# EasyEDA Pro project 嵌入式教学实验板-插件版-20240226.eprj

# Schematic 嵌入式教学实验PCB板原理图
Create Date: 2024-01-30; Page Name: P1; Project Name: 嵌入式教学实验; Schematic Name: 嵌入式教学实验PCB板原理图; Update Date: 2024-02-25; Company: 机器人工程系; Drawed: 白小帆; Page Size: A4; Reviewed: 张宏昌; Version: V1.0
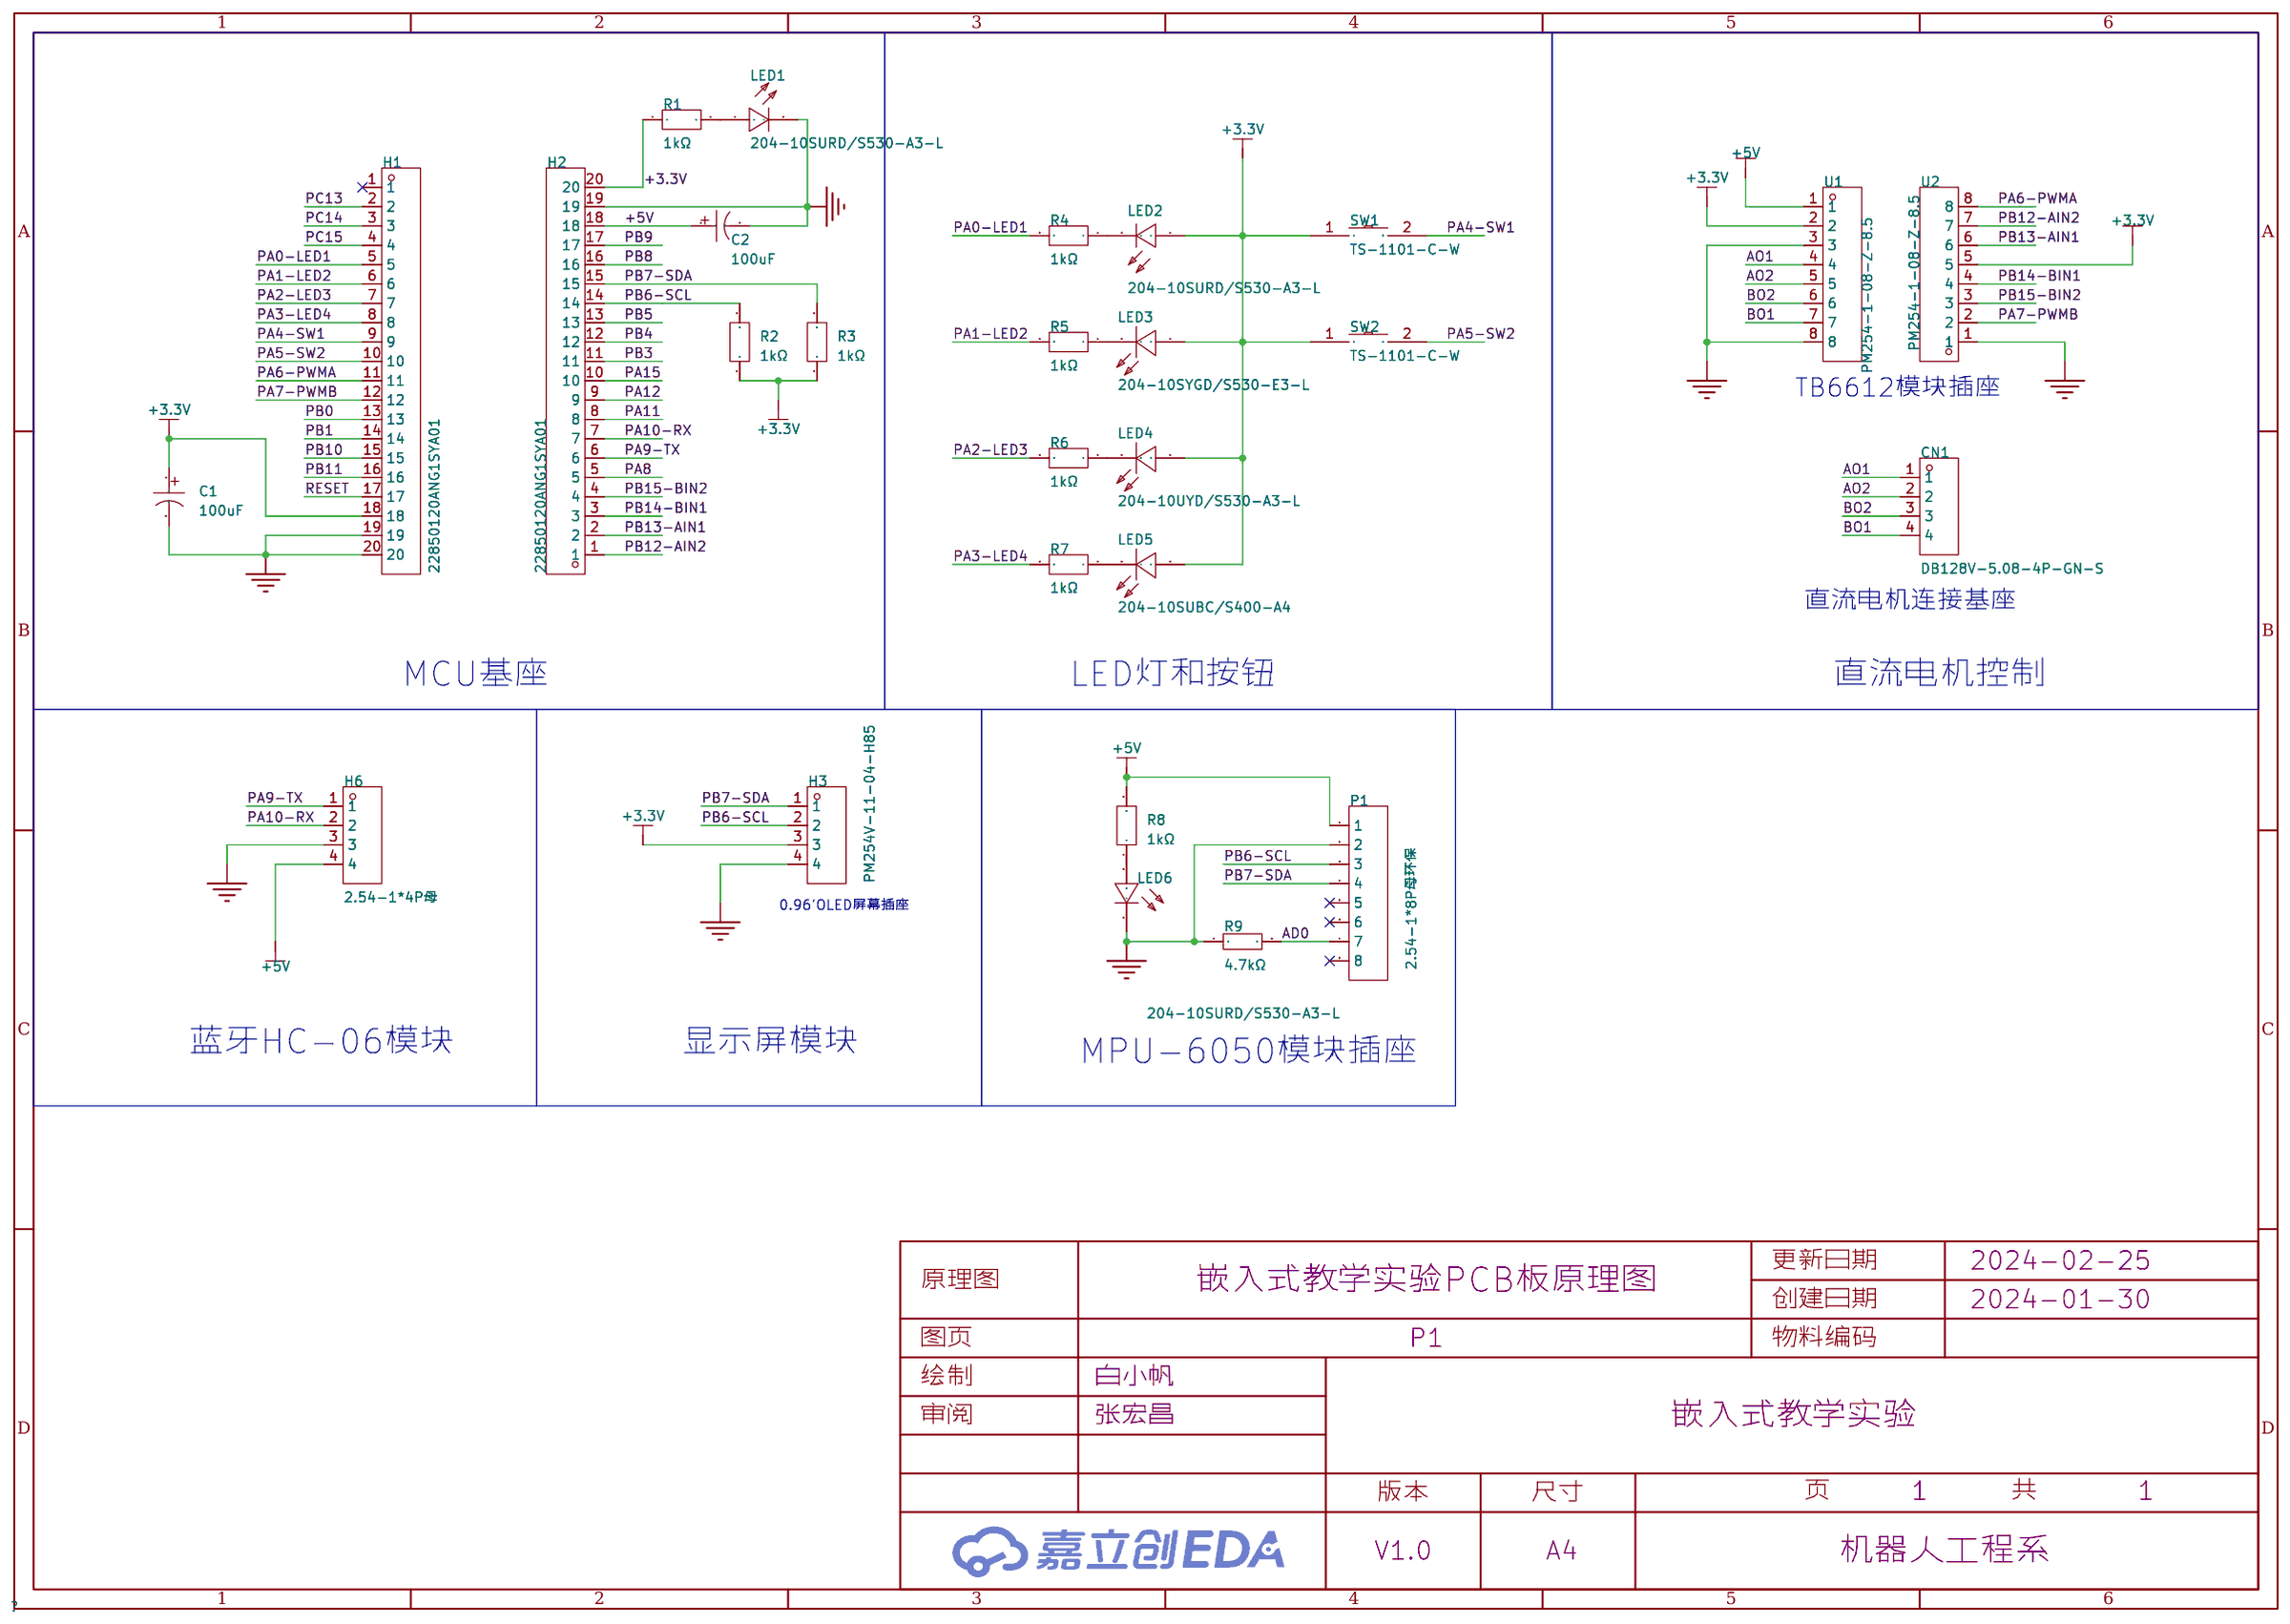
[diagram p0: schematic sheet]

## Parts
C1  100uF  [CAP-TH_BD8.0-P3.50-D0.6-FD]
C2  100uF  [CAP-TH_BD8.0-P3.50-D0.6-FD]
CN1  DB128V-5.08-4P-GN-S  [CONN-TH_4P-P5.08_DIBO_DB128V-5.08]
H1  22850120ANG1SYA01  [HDR-TH_20P-P2.54-V-F]
H2  22850120ANG1SYA01  [HDR-TH_20P-P2.54-V-F]
H3  PM254V-11-04-H85  [HDR-TH_4P-P2.54-V-F]
H6  2.54-1*4P母  [HDR-TH_4P-P2.54-V-F]
LED1  204-10SURD/S530-A3-L  [LED-TH_BD3.0-P2.54-FD]
LED2  204-10SURD/S530-A3-L  [LED-TH_BD3.0-P2.54-FD]
LED3  204-10SYGD/S530-E3-L  [LED-TH_BD3.0-P2.54-FD]
LED4  204-10UYD/S530-A3-L  [LED-TH_BD3.0-P2.54-FD]
LED5  204-10SUBC/S400-A4  [LED-TH_BD4.0-P2.54-FD]
LED6  204-10SURD/S530-A3-L  [LED-TH_BD3.0-P2.54-FD]
P1  2.54-1*8P母环保  [HDR-TH_8P-P2.54-V-F-1]
R1  1kΩ  [RES-TH_BD2.3-L6.5-P10.50-D0.5]
R2  1kΩ  [RES-TH_BD2.3-L6.5-P10.50-D0.5]
R3  1kΩ  [RES-TH_BD2.3-L6.5-P10.50-D0.5]
R4  1kΩ  [RES-TH_BD2.3-L6.5-P10.50-D0.5]
R5  1kΩ  [RES-TH_BD2.3-L6.5-P10.50-D0.5]
R6  1kΩ  [RES-TH_BD2.3-L6.5-P10.50-D0.5]
R7  1kΩ  [RES-TH_BD2.3-L6.5-P10.50-D0.5]
R8  1kΩ  [RES-TH_BD2.3-L6.5-P10.50-D0.5]
R9  4.7kΩ  [RES-TH_BD2.3-L6.5-P10.50-D0.5]
SW1  TS-1101-C-W  [SW-SMD_L6.0-W3.3-LS8.0]
SW2  TS-1101-C-W  [SW-SMD_L6.0-W3.3-LS8.0]
U1  PM254-1-08-Z-8.5  [HDR-TH_8P-P2.54-V-F]
U2  PM254-1-08-Z-8.5  [HDR-TH_8P-P2.54-V-F]

## Library data of the parts
C1 C2 = ERS1HM101F12OT: 容值:100uF;精度:±20%;额定电压:50V;; LCSC Part Name: 100uF ±20% 50V; Supplier Part: C112510; Manufacturer: AISHI(艾华集团); Supplier Footprint: 插件,D8xL12mm; JLCPCB Part Class: 扩展库; Datasheet: https://atta.szlcsc.com/upload/public/pdf/source/20191015/C438940_4B8E60A742BB0AE40DDEF87A5C89089D.pdf; Supplier: LCSC; Tolerance: ±20%; Rated Voltage: 50V; Lead Spacing: 3.5mm; φD: 8mm; L: 12mm; Lifetime @ Temp: 7000hrs@105℃
CN1 = DB128V-5.08-4P-GN-S: 结构:1x4P;间距:5.08mm;颜色:绿色;安装方式:直插;额定电流:20A;额定电压:300V;排数:1;线规 - AWG:12~30;线规 - 平方毫米:2.5;每排PIN数:4;工作温度范围:-40℃~+105℃;; LCSC Part Name: 5.08mm 1x4P 排数:1 每排P数:4 直插; Supplier Part: C2915641; Manufacturer: DORABO(地博电气); Supplier Footprint: 插件,P=5.08mm; JLCPCB Part Class: 扩展库; Datasheet: https://atta.szlcsc.com/upload/public/pdf/source/20230106/CC449C10514519CDCE20F1C37DBF2DAC.pdf; Supplier: LCSC; Structure: 1x4P; Pitch: 5.08mm; Color: 绿色; Mounting Style: 直插; Current Rating (Max): 20A; Voltage Rating (Max): 300V; Number of Pins: 4P; Number of Rows: 1; Wire Gauge - AWG: 12~30; Wire Gauge - mm2: 2.5; Number of PINs Per Row: 4; Operating Temperature Range: -40℃~+105℃
H1 H2 = 22850120ANG1SYA01: 排数:单排;总孔位数:20P;间距:2.54mm;插孔结构:1x20P;行距:-;安装类型:直插;塑高:-;触头材质:黄铜;触头镀层:-;; LCSC Part Name: 间距:2.54mm 1x20P 直插; Supplier Part: C429947; Manufacturer: JILN(锦凌); Supplier Footprint: 插件,P=2.54mm; JLCPCB Part Class: 扩展库; Datasheet: https://atta.szlcsc.com/upload/public/pdf/source/20190920/C429966_F6288D72CB1EF194DAF75E8AC5D57877.pdf; Supplier: LCSC; Number of Rows: 单排; Number of Holes: 20P; Pitch: 2.54mm; Holes Structure: 1x20P; Mounting Type: 直插; Contact Material: 黄铜
H3 = PM254V-11-04-H85: 插孔结构:1x4P;间距:2.54mm;行距:-;安装类型:直插;排数:单排;总孔位数:4P;塑高:-;触头材质:黄铜;触头镀层:-;; LCSC Part Name: 间距:2.54mm 1x4P 直插; Supplier Part: C541851; Manufacturer: XFCN(兴飞); Supplier Footprint: 插件,P=2.54mm; JLCPCB Part Class: 扩展库; Datasheet: https://atta.szlcsc.com/upload/public/pdf/source/20200518/C541849_85853D71FC67C51915A806977A588FDA.pdf; Supplier: LCSC; Holes Structure: 1x4P; Pitch: 2.54mm; Mounting Type: 直插; Number of Rows: 单排; Number of Holes: 4P; Contact Material: 黄铜
H6 = 2.54-1*4P母: 排数:单排;总孔位数:4P;间距:2.54mm;插孔结构:1x4P;行距:-;安装类型:直插;圆孔/方孔:方孔;额定电流:3A;额定电压:-;插孔方向:顶部;塑高:-;触头材质:青铜;触头镀层:-;工作温度范围:-40℃~+105℃;焊接温度(最大值):-;; LCSC Part Name: 间距:2.54mm 1x4P 直插; Supplier Part: C2718488; Manufacturer: BOOMELE(博穆精密); Supplier Footprint: 插件,P=2.54mm; JLCPCB Part Class: 扩展库; Datasheet: https://atta.szlcsc.com/upload/public/pdf/source/20210301/C2718488_F4427B881E42CAA8DDB0B1C12B3A522C.pdf; Supplier: LCSC; Number of Rows: 单排; Number of Holes: 4P; Pitch: 2.54mm; Holes Structure: 1x4P; Mounting Type: 直插; Circular Hole / Square Hole: 方孔; Current Rating (Max): 3A; Holes Direction: 顶部; Contact Material: 青铜; Operating Temperature Range: -40℃~+105℃
LED1 LED2 LED6 = 204-10SURD/S530-A3-L: 灯头类型:3mm圆形灯头;发光颜色:红色;功率:60mW;正向电流:20mA;主波长:624nm;二极管配置:-;透镜颜色:雾状红透镜;色温:-;发光角度:40°;载带方式:-;工作温度:-40℃~+85℃;; LCSC Part Name: 红灯; Supplier Part: C99771; Manufacturer: EVERLIGHT(亿光); Supplier Footprint: 插件,D=3mm; JLCPCB Part Class: 扩展库; Datasheet: https://atta.szlcsc.com/upload/public/pdf/source/20170504/1493866972127.pdf; Supplier: LCSC; Lamp Holder Type: 3mm圆形灯头; Emitted Color: 红色; Power Dissipation: 60mW; Forward Current: 20mA; Dominant Wavelength: 624nm; Peak Wavelength: 632nm; Lens Color: 雾状红透镜; Viewing Angle: 40°; Operating Temperature: -40℃~+85℃
LED3 = 204-10SYGD/S530-E3-L: 灯头类型:3mm圆形灯头;发光颜色:黄绿色;; LCSC Part Name: 普绿/黄绿; Supplier Part: C128785; Manufacturer: EVERLIGHT(亿光); Supplier Footprint: 插件,D=3mm; JLCPCB Part Class: 扩展库; Datasheet: https://atta.szlcsc.com/upload/public/pdf/source/20170914/C128785_1505359863627968031.pdf; Supplier: LCSC; Lamp Holder Type: 3mm圆形灯头; Emitted Color: 黄绿色
LED4 = 204-10UYD/S530-A3-L: 灯头类型:3mm圆形灯头;发光颜色:黄色;; LCSC Part Name: 黄灯; Supplier Part: C85160; Manufacturer: EVERLIGHT(亿光); Supplier Footprint: 插件,D=3mm; JLCPCB Part Class: 扩展库; Datasheet: https://atta.szlcsc.com/upload/public/pdf/source/20161027/1477535293515.pdf; Supplier: LCSC; Lamp Holder Type: 3mm圆形灯头; Emitted Color: 黄色
LED5 = 204-10SUBC/S400-A4: 灯头类型:3mm圆形灯头;发光颜色:蓝色;; LCSC Part Name: 蓝灯; Supplier Part: C86881; Manufacturer: EVERLIGHT(亿光); Supplier Footprint: 插件,D=3mm; JLCPCB Part Class: 扩展库; Datasheet: https://atta.szlcsc.com/upload/public/pdf/source/20170105/1483610751739.pdf; Supplier: LCSC; Lamp Holder Type: 3mm圆形灯头; Emitted Color: 蓝色
P1 = 2.54-1*8P母环保: 排数:单排;总孔位数:8P;间距:2.54mm;插孔结构:1x8P;行距:-;安装类型:直插;塑高:-;触头材质:-;触头镀层:-;; LCSC Part Name: 间距:2.54mm 1x8P 直插; Supplier Part: C27438; Manufacturer: BOOMELE(博穆精密); Supplier Footprint: 插件,P=2.54mm; JLCPCB Part Class: 扩展库; Datasheet: https://atta.szlcsc.com/upload/public/pdf/source/20210301/C2718488_F4427B881E42CAA8DDB0B1C12B3A522C.pdf; Supplier: LCSC; Number of Rows: 单排; Number of Holes: 8P; Pitch: 2.54mm; Holes Structure: 1x8P; Mounting Type: 直插
R1-R8 = MF1/4W-1KΩ±1%T52: 电阻类型:金属膜电阻;阻值:1kΩ;精度:±1%;功率:250mW;温度系数:±200ppm/℃;; LCSC Part Name: 金属膜电阻 1kΩ ±1% 250mW; Supplier Part: C713997; Manufacturer: 华星机电; Supplier Footprint: 插件; JLCPCB Part Class: 扩展库; Datasheet: https://atta.szlcsc.com/upload/public/pdf/source/20200731/C713882_AE8EB1102749D7E4FB4FB13DC898C429.pdf; Supplier: LCSC; Type: 金属膜电阻; Tolerance: ±1%; Power(Watts): 250mW; Temperature Coefficient: ±200ppm/℃
R9 = MF1/4W-4.7KΩ±1% T: 电阻类型:金属膜电阻;阻值:4.7kΩ;精度:±1%;功率:250mW;温度系数:±100ppm/℃;; LCSC Part Name: 4.7kΩ ±1% 250mW 金属膜电阻; Supplier Part: C119339; Manufacturer: CCO(千志电子); Supplier Footprint: 插件; JLCPCB Part Class: 扩展库; Datasheet: https://atta.szlcsc.com/upload/public/pdf/source/20190910/C427326_62A6D058BC0FF74963A2F22379CA06CE.pdf; Supplier: LCSC; Type: 金属膜电阻; Tolerance: ±1%; Overload Voltage (Max): 250V; Power(Watts): 250mW; Temperature Coefficient: ±100ppm/℃; Operating Temperature Range: -55℃~+155℃
SW1 SW2 = TS-1101-C-W: 电路结构:单刀单掷;按钮形状:矩形按钮;开关长度:6mm;开关宽度:3.6mm;开关高度:2.5mm;带支架:不带;触点电流:50mA;额定电压(AC):-;额定电压(DC):12V;额定功率:-;安装方式:立贴;绝缘电阻:-;带灯:无;作用力:260gf;机械寿命:5万次;; LCSC Part Name: 6*3.6*2.5mm 立贴 轻触开关; Supplier Part: C318938; Manufacturer: XKB Connectivity(中国星坤); Supplier Footprint: SMD; JLCPCB Part Class: 扩展库; Datasheet: https://atta.szlcsc.com/upload/public/pdf/source/20200227/C318938_C2E53B1EEDE37D980A33616AC086DE53.pdf; Supplier: LCSC; Circuit: 单刀单掷; Actuator Style: 矩形按钮; Switch Length: 6mm; Switch Width: 3.6mm; Switch Height: 2.5mm; Strike Gundam: 不带; Contact Current: 50mA; Voltage Rating (DC): 12V; Mounting Style: 立贴; Actuator/Cap Color: 白色带淡绿; With Lamp: 无; Operating Force: 260gf; Mechanical Life: 5万次; Operating Temperature: -30℃~+85℃
U1 U2 = PM254-1-08-Z-8.5: 排数:单排;总孔位数:8P;间距:2.54mm;插孔结构:1x8P;行距:-;安装类型:直插;圆孔/方孔:方孔;额定电流:3A;额定电压:-;插孔方向:顶部;塑高:8.5mm;工作温度范围:-40℃~+105℃;; LCSC Part Name: 间距:2.54mm 1x8P 直插; Supplier Part: C2897371; Manufacturer: HCTL(华灿天禄); Supplier Footprint: 插件,P=2.54mm; JLCPCB Part Class: 扩展库; Datasheet: https://atta.szlcsc.com/upload/public/pdf/source/20230609/534BE42964C679BDE98E061007C4ABD6.pdf; Supplier: LCSC; Number of Rows: 单排; Number of Holes: 8P; Pitch: 2.54mm; Holes Structure: 1x8P; Mounting Type: 直插; Circular Hole / Square Hole: 方孔; Current Rating (Max): 3A; Holes Direction: 顶部; Insulation Height: 8.5mm; Operating Temperature Range: -40℃~+105℃

## Nets
+3.3V: C1.1 H1.18 H2.20 H3.3 LED2.1(A) LED3.1(A) LED4.1(A) LED5.1(+) R1.1 R2.1 R3.1 SW1.1 SW2.1 U1.2 U2.5
+5V: C2.1 H2.18 H6.4 P1.1 R8.2 U1.1
GND: C1.2 C2.2 H1.19 H1.20 H2.19 H3.4 H6.3 LED1.2(K) LED6.2(K) P1.2 R9.1 U1.3 U1.8 U2.1
AD0: P1.7 R9.2
AO1: CN1.1 U1.4
AO2: CN1.2 U1.5
BO1: CN1.4 U1.7
BO2: CN1.3 U1.6
PA0-LED1: H1.5 R4.2
PA1-LED2: H1.6 R5.2
PA2-LED3: H1.7 R6.2
PA3-LED4: H1.8 R7.2
PA4-SW1: H1.9 SW1.2
PA5-SW2: H1.10 SW2.2
PA6-PWMA: H1.11 U2.8
PA7-PWMB: H1.12 U2.2
PA8: H2.5
PA9-TX: H2.6 H6.1
PA10-RX: H2.7 H6.2
PA11: H2.8
PA12: H2.9
PA15: H2.10
PB0: H1.13
PB1: H1.14
PB3: H2.11
PB4: H2.12
PB5: H2.13
PB6-SCL: H2.14 H3.2 P1.3 R2.2
PB7-SDA: H2.15 H3.1 P1.4 R3.2
PB8: H2.16
PB9: H2.17
PB10: H1.15
PB11: H1.16
PB12-AIN2: H2.1 U2.7
PB13-AIN1: H2.2 U2.6
PB14-BIN1: H2.3 U2.4
PB15-BIN2: H2.4 U2.3
PC13: H1.2
PC14: H1.3
PC15: H1.4
RESET: H1.17
$1N2205: LED6.1(A) R8.1
$1N6618: LED2.2(K) R4.1
$1N6964: LED1.1(A) R1.2
$1N7082: LED3.2(K) R5.1
$1N7148: LED4.2(K) R6.1
$1N7214: LED5.2(-) R7.1

Not connected (* = marked no-connect by the designer): H1 1*; P1 5* 6* 8*

## Notes on the sheet
- TB6612模块插座
- 直流电机连接基座
- MCU基座
- LED灯和按钮
- 直流电机控制
- 0.96'OLED屏幕插座
- 蓝牙HC-06模块
- 显示屏模块
- MPU-6050模块插座

# Board PCB1
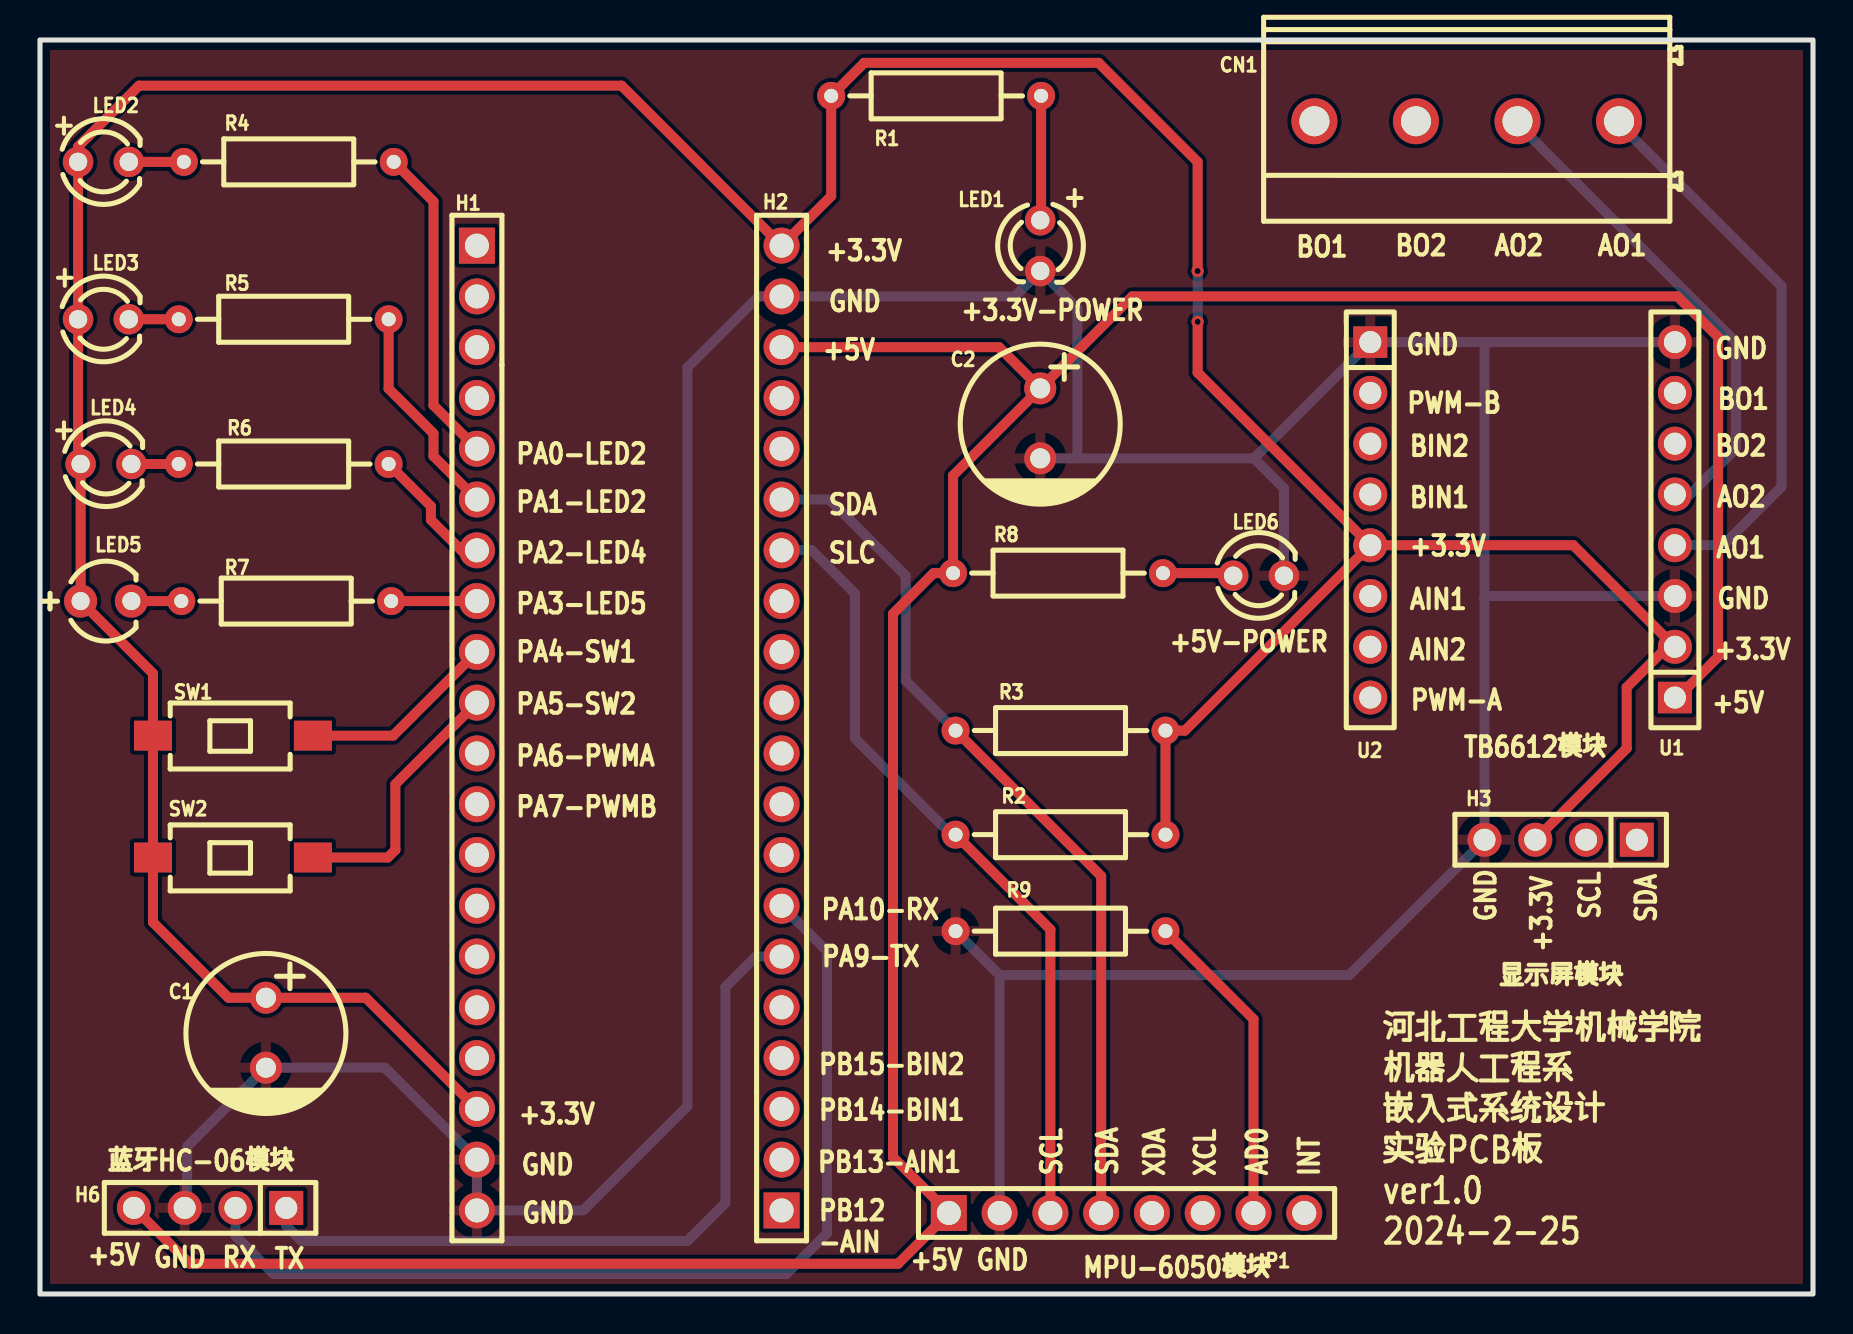
[diagram p1: board, top side]
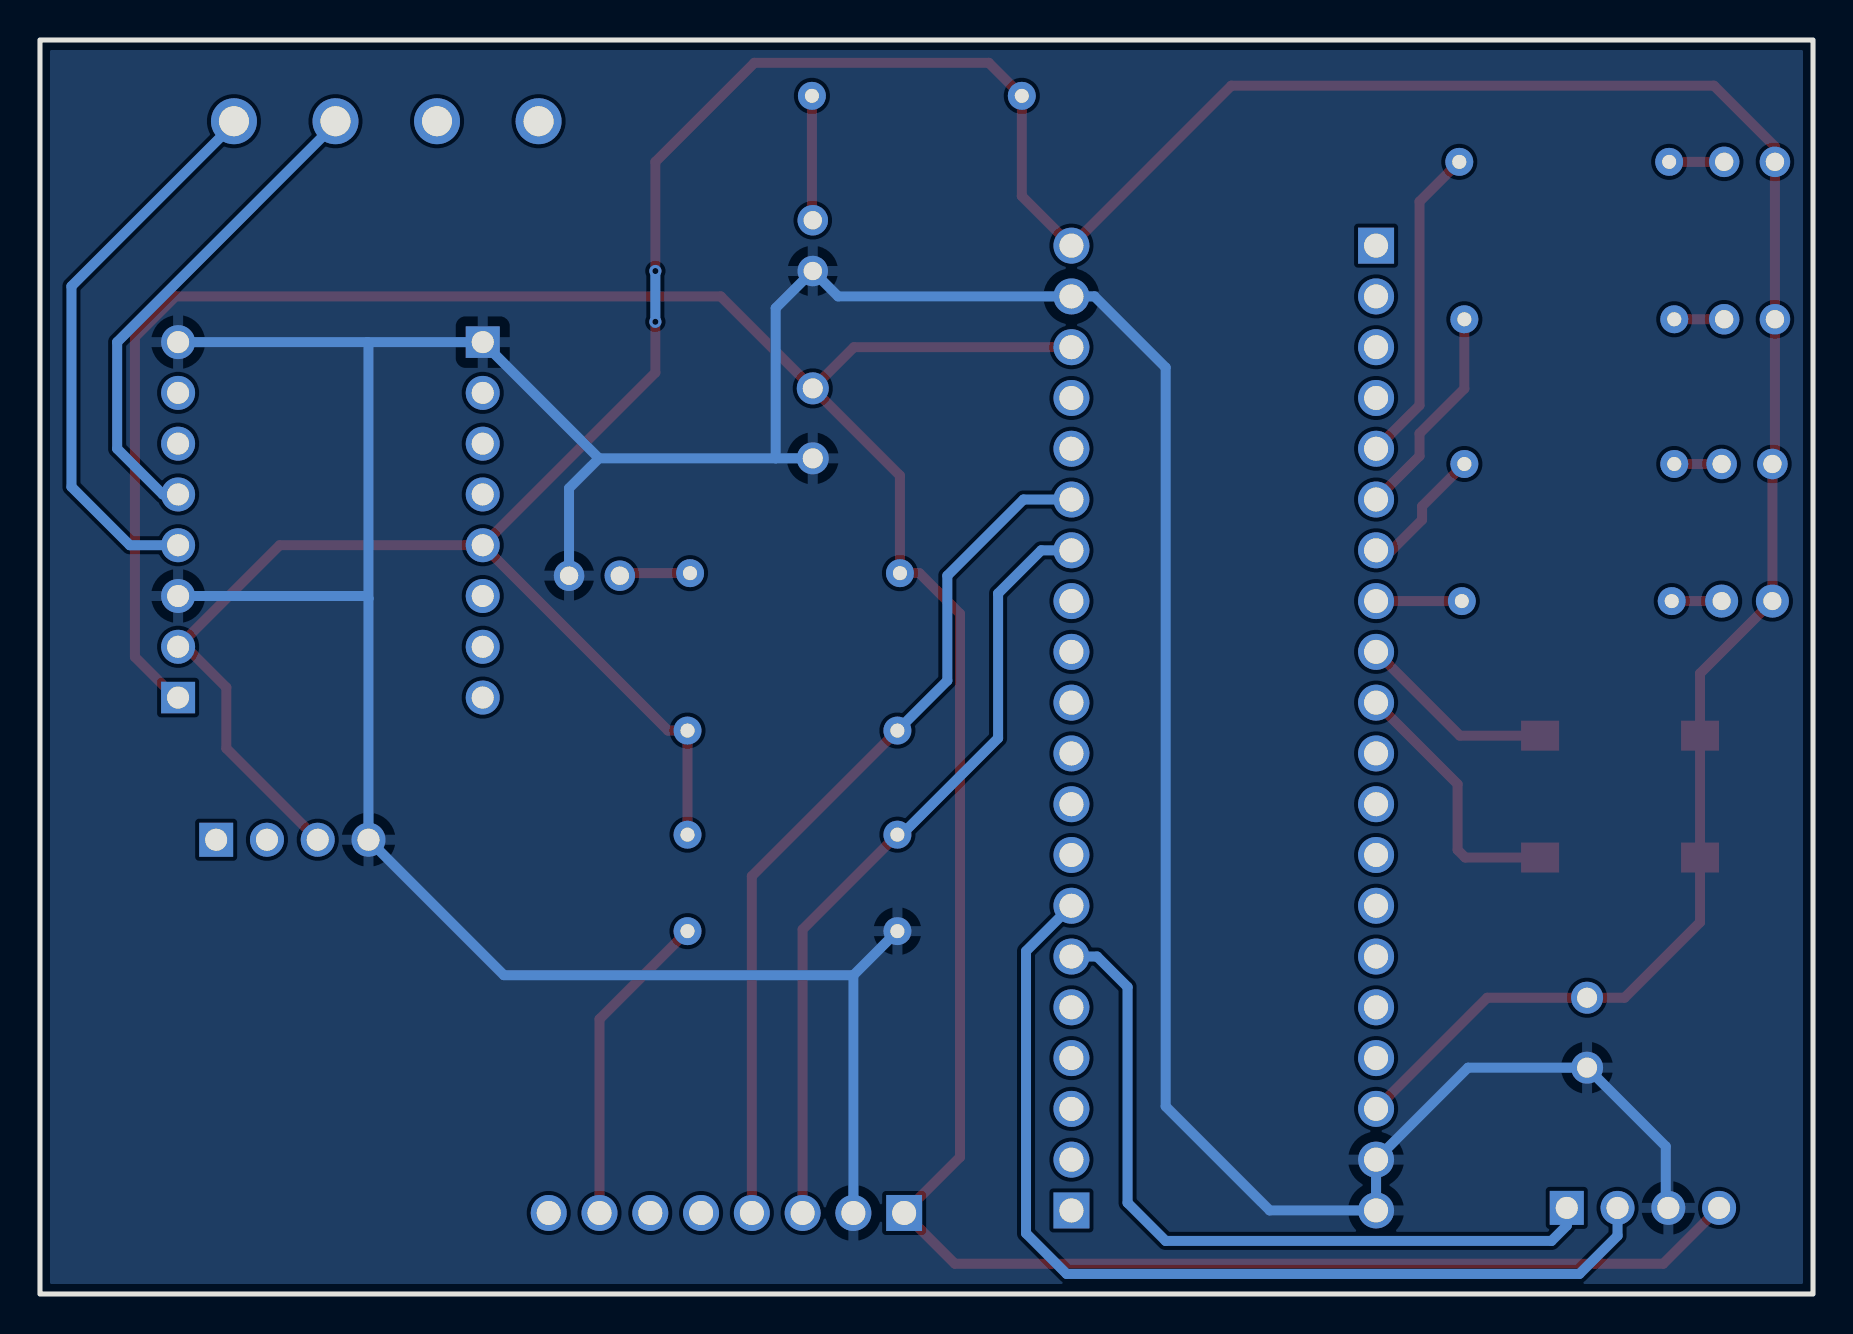
[diagram p2: board, bottom side, seen from below]

Outline 88.7 x 62.73 mm; copper layers: Top Layer, Inner1, Inner2, Bottom Layer. Coordinates in mm from the lower left corner of the outline.
Outline path: rectangle 0,62.73 88.7,0
Stack: Top Layer 0.035mm 外层铜厚1oz / Dielectric1 0.2104mm 7628 RC49% 8.6mil / Inner1 0.0152mm 内层铜厚 / Dielectric2 1.065mm 1.1mm H/HOZ 含铜 / Inner2 0.0152mm 内层铜厚 / Dielectric3 0.2104mm 7628 RC49% 8.6mil / Bottom Layer 0.035mm 外层铜厚1oz

## Design rules (mm)
template: JLCPCB Capability(Two Layers Board)
spacing copperThickness1oz (default): track to track 0.102, other pairs 0.152 to 0.3
spacing copperThickness2oz: track to track 0.203, other pairs 0.152 to 0.3
track width copperThickness1oz (default): min 0.127, default 0.254, max 2.54
track width copperThickness2oz: min 0.203, default 0.254, max 2.54
differential pair differentialPair (default): width min 0.127, default 0.254, max 2.54; gap min 0.152, default 0.152
via viaSize (default): diameter min 0.5, default 0.61, max 10; hole min 0.3, default 0.305, max 6.3

## Placement (name value [footprint] x y rotation side)
C1  100uF  [CAP-TH_BD8.0-P3.50-D0.6-FD]  11.3 13.07 270 top
C2  100uF  [CAP-TH_BD8.0-P3.50-D0.6-FD]  50.04 43.55 270 top
CN1  DB128V-5.08-4P-GN-S  [CONN-TH_4P-P5.08_DIBO_DB128V-5.08]  71.37 58.66 180 top
H1  22850120ANG1SYA01  [HDR-TH_20P-P2.54-V-F]  21.86 28.31 270 top
H2  22850120ANG1SYA01  [HDR-TH_20P-P2.54-V-F]  37.1 28.31 90 top
H3  PM254V-11-04-H85  [HDR-TH_4P-P2.54-V-F]  76.07 22.72 180 top
H6  2.54-1*4P母  [HDR-TH_4P-P2.54-V-F]  8.51 4.31 180 top
LED1  204-10SURD/S530-A3-L  [LED-TH_BD3.0-P2.54-FD]  50.04 52.44 270 top
LED2  204-10SURD/S530-A3-L  [LED-TH_BD3.0-P2.54-FD]  3.17 56.63 0 top
LED3  204-10SYGD/S530-E3-L  [LED-TH_BD3.0-P2.54-FD]  3.17 48.76 0 top
LED4  204-10UYD/S530-A3-L  [LED-TH_BD3.0-P2.54-FD]  3.3 41.52 0 top
LED5  204-10SUBC/S400-A4  [LED-TH_BD4.0-P2.54-FD]  3.3 34.66 0 top
LED6  204-10SURD/S530-A3-L  [LED-TH_BD3.0-P2.54-FD]  60.96 35.93 0 top
P1  2.54-1*8P母环保  [HDR-TH_8P-P2.54-V-F-1]  54.36 4.05 0 top
R1  1kΩ  [RES-TH_BD2.3-L6.5-P10.50-D0.5]  44.83 59.93 0 top
R2  1kΩ  [RES-TH_BD2.3-L6.5-P10.50-D0.5]  51.05 22.98 180 top
R3  1kΩ  [RES-TH_BD2.3-L6.5-P10.50-D0.5]  51.05 28.18 180 top
R4  1kΩ  [RES-TH_BD2.3-L6.5-P10.50-D0.5]  12.45 56.63 0 top
R5  1kΩ  [RES-TH_BD2.3-L6.5-P10.50-D0.5]  12.19 48.76 0 top
R6  1kΩ  [RES-TH_BD2.3-L6.5-P10.50-D0.5]  12.19 41.52 0 top
R7  1kΩ  [RES-TH_BD2.3-L6.5-P10.50-D0.5]  12.32 34.66 0 top
R8  1kΩ  [RES-TH_BD2.3-L6.5-P10.50-D0.5]  50.93 36.06 180 top
R9  4.7kΩ  [RES-TH_BD2.3-L6.5-P10.50-D0.5]  51.05 18.15 0 top
SW1  TS-1101-C-W  [SW-SMD_L6.0-W3.3-LS8.0]  9.65 27.93 0 top
SW2  TS-1101-C-W  [SW-SMD_L6.0-W3.3-LS8.0]  9.65 21.83 0 top
U1  PM254-1-08-Z-8.5  [HDR-TH_8P-P2.54-V-F]  81.79 38.72 90 top
U2  PM254-1-08-Z-8.5  [HDR-TH_8P-P2.54-V-F]  66.55 38.72 270 top

## Footprints (pads in the part's own frame, mm; a bottom-side part is the same pattern mirrored in y, then rotated)
CAP-TH_BD8.0-P3.50-D0.6-FD
  round 1.6 hole 1: 1(-1.75,0) 2(1.75,0)
CONN-TH_4P-P5.08_DIBO_DB128V-5.08
  round 2.3 hole 1.5: 1(-7.62,0) 2(-2.54,0) 3(2.54,0) 4(7.62,0)
HDR-TH_4P-P2.54-V-F
  rect 1.7x1.7 hole 1.1: 1(-3.81,0)
  round 1.7 hole 1.1: 2(-1.27,0) 3(1.27,0) 4(3.81,0)
HDR-TH_8P-P2.54-V-F
  rect 1.575x1.7 hole 1.1: 1(-8.89,0)
  round 1.7 hole 1.1: 2(-6.35,0) 3(-3.81,0) 4(-1.27,0) 5(1.27,0) 6(3.81,0) 7(6.35,0) 8(8.89,0)
HDR-TH_8P-P2.54-V-F-1
  rect 1.8x1.8 hole 1.2: 1(-8.89,0)
  round 1.8 hole 1.2: 2(-6.35,0) 3(-3.81,0) 4(-1.27,0) 5(1.27,0) 6(3.81,0) 7(6.35,0) 8(8.89,0)
HDR-TH_20P-P2.54-V-F
  rect 1.8x1.8 hole 1.2: 1(-24.13,0)
  round 1.8 hole 1.2: 2(-21.59,0) 3(-19.05,0) 4(-16.51,0) 5(-13.97,0) 6(-11.43,0) 7(-8.89,0) 8(-6.35,0) 9(-3.81,0) 10(-1.27,0) 11(1.27,0) 12(3.81,0) 13(6.35,0) 14(8.89,0) 15(11.43,0) 16(13.97,0) 17(16.51,0) 18(19.05,0) 19(21.59,0) 20(24.13,0)
LED-TH_BD3.0-P2.54-FD
  round 1.524 hole 0.914: 1(-1.27,0) 2(1.27,0)
LED-TH_BD4.0-P2.54-FD
  round 1.651 hole 0.9: 1(-1.27,0) 2(1.27,0)
RES-TH_BD2.3-L6.5-P10.50-D0.5
  round 1.4 hole 0.7: 1(-5.25,0) 2(5.25,0)
SW-SMD_L6.0-W3.3-LS8.0
  rect 1.9x1.5 smd: 1(-4,0) 2(4,0)

## Nets
As in the schematic.

Pads without a net: H1 1; P1 5 6 8

## Via types
v1: diameter 0.61, hole 0.305, Top Layer to Bottom Layer, 2 vias

## Routing (per net, layer and track width the routed paths; a pad name or vN(x,y) marks a point on that pad's centre or on a via; arc(x,y) is an arc through that point)
+3.3V: length 201.9
  Top Layer w0.5: H1.18 16.3,14.82 C1.1 9.43,14.82 5.65,18.59 SW2.1 SW1.1 5.65,31.04 LED5.1 LED4.1 1.91,41.65 LED3.1 LED2.1 1.91,57.39 4.95,60.44 29.1,60.44 37.1,52.44 39.58,54.92 R1.1 41.23,61.58 52.96,61.58 57.91,56.63 v1(57.91,51.17) ; U2.5 76.71,37.45 U1.2 81.41,32.38 79.37,30.34 79.37,27.3 H3.3 ; U2.5 57.91,46.09 v1(57.91,48.63) ; U2.5 57.28,28.18 R3.1 R2.1
  Bottom Layer w0.5: v1(57.91,51.17) v1(57.91,48.63)
+5V: length 158.5
  Top Layer w0.5: U1.1 81.92,29.83 83.95,31.87 83.95,47.87 81.92,49.9 54.64,49.9 C2.1 ; H6.4 7.49,1.51 42.93,1.51 P1.1 42.67,6.85 42.67,34.03 44.7,36.06 R8.2 45.68,40.94 C2.1 ; C2.1 47.98,47.36 37.1,47.36
GND: length 220.3
  Bottom Layer w0.5: LED6.2 62.23,40.3 60.73,41.8 ; H6.3 7.37,4.44 7.37,7.38 C1.2 17.26,11.32 21.86,6.72 21.86,4.18 27.18,4.18 32.39,9.39 32.39,46.34 35.94,49.9 H2.19 48.77,49.9 LED1.2 51.89,49.32 51.89,41.8 ; 51.89,41.8 C2.2 ; 51.89,41.8 60.73,41.8 ; 72.33,47.61 U1.8 ; 72.33,47.61 U2.1 60.73,41.8 ; 72.33,47.61 72.26,47.55 72.26,34.79 ; 72.26,34.79 72.39,34.92 U1.3 ; 72.26,34.79 H3.4 65.49,15.95 48.01,15.95 ; 48.01,15.95 P1.2 ; 48.01,15.95 R9.1
AD0: length 15.9
  Top Layer w0.5: P1.7 60.71,13.75 R9.2
AO1: length 28.1
  Bottom Layer w0.5: 78.99,58.54 87.12,50.41 87.12,40.38 84.2,37.45 U1.4
AO2: length 24.8
  Bottom Layer w0.5: 73.91,58.54 84.84,47.61 84.84,42.28 82.55,40 U1.5
BO1: length 23.6
  Inner1 w0.5: U1.7 77.22,45.08 63.75,58.54
BO2: length 36
  Inner1 w0.5: U1.6 85.98,46.73 85.98,56.12 80.52,61.58 71.88,61.58 68.83,58.54
PA0-LED1: length 16.4
  Top Layer w0.35: R4.2 18.03,56.63
  Top Layer w0.5: R4.2 19.69,54.64 19.69,44.45 21.86,42.28
PA1-LED2: length 10.8
  Top Layer w0.5: R5.2 17.44,45.29 19.69,43.04 19.69,41.91 21.86,39.74
PA2-LED3: length 6.6
  Top Layer w0.5: R6.2 19.56,39.4 19.56,38.72 21.08,37.2 H1.7
PA3-LED4: length 4.3
  Top Layer w0.5: R7.2 21.86,34.66
PA4-SW1: length 9.9
  Top Layer w0.5: H1.9 17.67,27.93 SW1.2
PA5-SW2: length 13.3
  Top Layer w0.5: SW2.2 17.4,21.83 17.78,22.22 17.78,25.5 21.86,29.58
PA6-PWMA: length 79.5
  Inner1 w0.5: U2.8 66.55,20.82 60.2,14.47 50.67,14.47 38.73,2.53 32.64,2.53 29.72,5.45 29.72,19.18 H1.11
PA7-PWMB: length 99.6
  Inner1 w0.5: 21.86,24.5 27.81,18.55 27.81,4.44 30.86,1.39 40.43,1.39 50.84,11.8 61.21,11.8 69.72,20.31 69.72,41.9 U2.2
PA9-TX: length 38.2
  Bottom Layer w0.5: H2.6 35.81,16.88 34.29,15.36 34.29,4.56 32.39,2.66 13.08,2.66 12.32,3.42 H6.1
PA10-RX: length 49.9
  Bottom Layer w0.5: H6.2 9.78,2.91 11.68,1.01 37.34,1.01 39.37,3.04 39.37,17.15 H2.7
PB6-SCL: length 76.3
  Top Layer w0.5: R2.2 50.55,18.23 P1.3
  Inner1 w0.5: P1.3 56.01,9.52 67.56,9.52 77.34,19.29 H3.2
  Bottom Layer w0.5: R2.2 45.59,22.98 40.77,27.8 40.77,35.04 38.61,37.2 H2.14
PB7-SDA: length 80.1
  Top Layer w0.5: P1.4 53.09,20.9 R3.2
  Inner1 w0.5: H3.1 79.88,19.55 67.82,7.48 56.52,7.48 P1.4
  Bottom Layer w0.5: R3.2 43.31,30.68 43.31,35.93 39.5,39.74 37.1,39.74
PB12-AIN2: length 42.5
  Inner1 w0.5: U2.7 59.05,24.88 59.05,22.47 57.15,20.56 54.19,20.56 37.81,4.18 37.1,4.18
PB13-AIN1: length 47.6
  Inner1 w0.5: U2.6 65.45,33.81 53.13,33.81 48.01,28.69 48.01,17.63 37.1,6.72
PB14-BIN1: length 50
  Inner1 w0.5: U2.4 64.39,37.84 52.32,37.84 43.81,29.33 43.81,15.98 H2.3
PB15-BIN2: length 53.1
  Inner1 w0.5: U2.3 59.18,42.53 56.64,40 46.61,40 41.02,34.41 41.02,15.72 37.1,11.8
$1N2205: length 3.6
  Top Layer w0.5: R8.1 59.56,36.06 LED6.1
$1N6618: length 2.8
  Top Layer w0.5: LED2.2 R4.1
$1N6964: length 6.2
  Top Layer w0.5: LED1.1 50.08,53.75 R1.2
$1N7082: length 2.5
  Top Layer w0.5: LED3.2 R5.1
$1N7148: length 2.4
  Top Layer w0.5: LED4.2 R6.1
$1N7214: length 2.5
  Top Layer w0.5: LED5.2 R7.1

## Copper pours and planes (outline as drawn; the poured copper is in the pictures)
GND on Top Layer: -0.51,63.49 89.15,63.49 89.15,-0.65 -0.51,-0.65
GND on Bottom Layer: -0.25,63.49 89.21,63.49 89.21,0 -0.25,0
GND on Inner1: -0.51,63.49 89.15,63.49 89.15,-0.39 -0.51,-0.39

## Text on the board
Top Silkscreen Layer: GND | RX | TX | BO1 | BO2 | AO2 | AO1 | SCL | SDA | XDA | XCL | AD0 | INT | +3.3V | +5V | PA0-LED2 | PA1-LED2 | PA2-LED4 | PA3-LED5 | PA4-SW1 | PA5-SW2 | PA6-PWMA | PA7-PWMB | PB13-AIN1 | PB15-BIN2 | PB14-BIN1 | PB12 / -AIN | PA10-RX | PA9-TX | SLC | +3.3V-POWER | +5V-POWER | PWM-B | AIN2 | BIN2 | BIN1 | AIN1 | PWM-A | + | 蓝牙HC-06模块 | MPU-6050模块 | TB6612模块 | 显示屏模块 | 河北工程大学机械学院 / 机器人工程系 / 嵌入式系统设计 / 实验PCB板 / ver1.0 / 2024-2-25
